# Altium schematic sheet LED Driver.SchDoc
size Letter
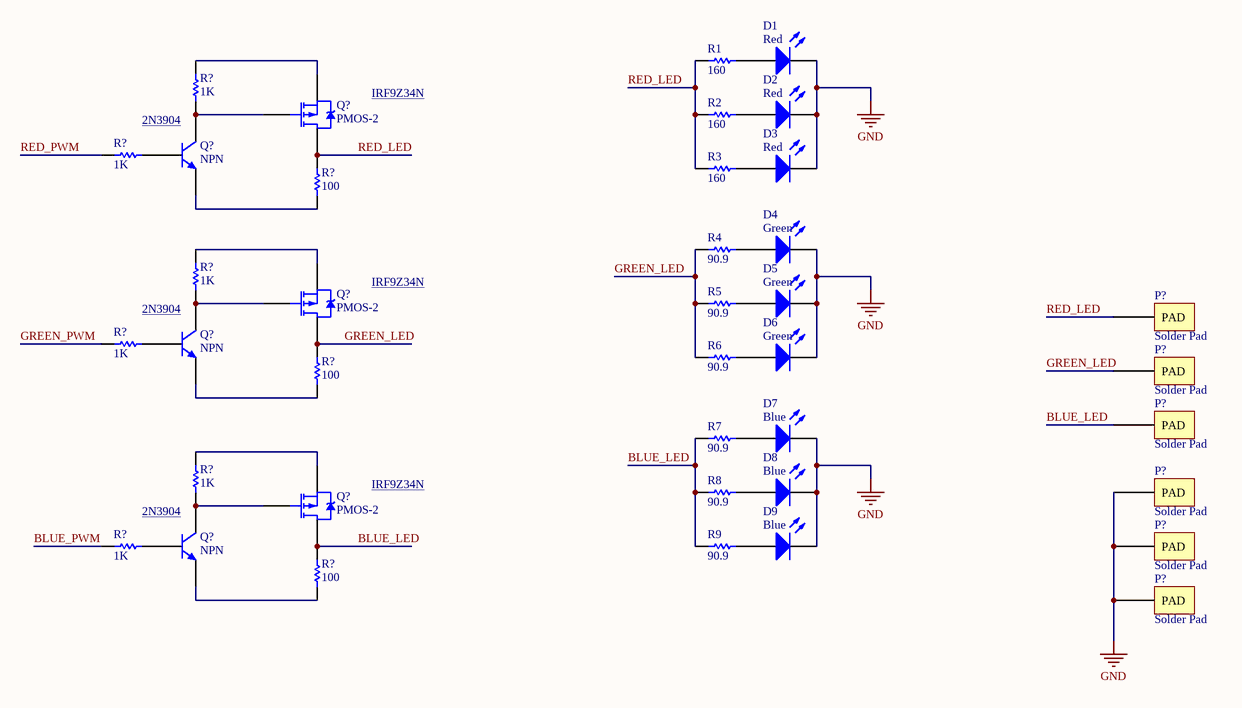
[diagram p0: LED Driver.SchDoc]

## Parts
(Parts that share a designator on the sheet are numbered #1, #2 ... from top to bottom, then left to right.)
D1  Red  [LED-5MM]
D2  Red  [LED-5MM]
D3  Red  [LED-5MM]
D4  Green  [LED-5MM]
D5  Green  [LED-5MM]
D6  Green  [LED-5MM]
D7  Blue  [LED-5MM]
D8  Blue  [LED-5MM]
D9  Blue  [LED-5MM]
P?#1  Solder Pad  [Solder Pad]
P?#2  Solder Pad  [Solder Pad]
P?#3  Solder Pad  [Solder Pad]
P?#4  Solder Pad  [Solder Pad]
P?#5  Solder Pad  [Solder Pad]
P?#6  Solder Pad  [Solder Pad]
Q?#1  PMOS-2  [TO-220AB]
Q?#2  NPN  [TO-226-AA]
Q?#3  PMOS-2  [TO-220AB]
Q?#4  NPN  [TO-226-AA]
Q?#5  PMOS-2  [TO-220AB]
Q?#6  NPN  [TO-226-AA]
R1  160  [RES_8085]
R2  160  [RES_8085]
R3  160  [RES_8085]
R4  90.9  [RES_8085]
R5  90.9  [RES_8085]
R6  90.9  [RES_8085]
R7  90.9  [RES_8085]
R8  90.9  [RES_8085]
R9  90.9  [RES_8085]
R?#1  1K  [RES_8085]
R?#2  1K  [RES_8085]
R?#3  100  [RES_8085]
R?#4  1K  [RES_8085]
R?#5  1K  [RES_8085]
R?#6  100  [RES_8085]
R?#7  1K  [RES_8085]
R?#8  1K  [RES_8085]
R?#9  100  [RES_8085]

## Nets
GND: D1.2(K) D2.2(K) D3.2(K) D4.2(K) D5.2(K) D6.2(K) D7.2(K) D8.2(K) D9.2(K) P?#4.0(PAD) P?#5.0(PAD) P?#6.0(PAD)
BLUE_LED: P?#3.0(PAD) Q?#5.2(D) R7.1 R8.1 R9.1 R?#9.2
BLUE_PWM: R?#8.1
GREEN_LED: P?#2.0(PAD) Q?#3.2(D) R4.1 R5.1 R6.1 R?#6.2
GREEN_PWM: R?#5.1
RED_LED: P?#1.0(PAD) Q?#1.2(D) R1.1 R2.1 R3.1 R?#3.2
RED_PWM: R?#2.1
NetD1_1: D1.1(A) R1.2
NetD2_1: D2.1(A) R2.2
NetD3_1: D3.1(A) R3.2
NetD4_1: D4.1(A) R4.2
NetD5_1: D5.1(A) R5.2
NetD6_1: D6.1(A) R6.2
NetD7_1: D7.1(A) R7.2
NetD8_1: D8.1(A) R8.2
NetD9_1: D9.1(A) R9.2
NetQ?#1_1: Q?#1.1(G) Q?#2.1(C) R?#1.1
NetQ?#1_3: Q?#1.3(S) R?#1.2
NetQ?#2_2: Q?#2.2(B) R?#2.2
NetQ?#2_3: Q?#2.3(E) R?#3.1
NetQ?#3_1: Q?#3.1(G) Q?#4.1(C) R?#4.1
NetQ?#3_3: Q?#3.3(S) R?#4.2
NetQ?#4_2: Q?#4.2(B) R?#5.2
NetQ?#4_3: Q?#4.3(E) R?#6.1
NetQ?#5_1: Q?#5.1(G) Q?#6.1(C) R?#7.1
NetQ?#5_3: Q?#5.3(S) R?#7.2
NetQ?#6_2: Q?#6.2(B) R?#8.2
NetQ?#6_3: Q?#6.3(E) R?#9.1

## Notes on the sheet
- IRF9Z34N
- 2N3904

## Library data of the parts
D1-D9 = D_LED: General Purpose LED; ComponentLink2Description: Green 5mm (C503B-GCS-CY0C0791); ComponentLink1URL: http://www.cree.com/~/media/Files/Cree/LED%20Components%20and%20Modules/HB/Data%20Sheets/C503B%20RAS%20RAN%20AAS%20AAN%20RBS%20RBN%20ABS%20ABN%20RCS%20RCN%20ACS%20ACN%201079.pdf; Supplier 1: Digi-Key; Supplier 2: Digi-Key; Supplier 3: Digi-Key; Supplier Part Number 1: C503B-GCS-CY0C0791-ND; Supplier Part Number 2: C503B-BAN-CY0C0461-ND; Supplier Part Number 3: C503B-RAS-CY0B0AA1-ND; ComponentLink3Description: Blue 5mm (C503B-BAN-CY0C0461); ComponentLink1Description: Red 5mm (C503B-RAS-CY0B0AA1); ComponentLink2URL: http://www.cree.com/~/media/Files/Cree/LED%20Components%20and%20Modules/HB/Data%20Sheets/C503B%20BAS%20BAN%20BCS%20BCN%20GAS%20GAN%20GCS%20GCN%201094.pdf; ComponentLink3URL: http://www.cree.com/sitecore%20modules/web/~/media/Files/Cree/LED%20Components%20and%20Modules/HB/Data%20Sheets/1300%20C503B%20BAS%20BAN%20GAS%20GAN.pdf
Q?#1 Q?#3 Q?#5 = PMOS-2: P-Channel Power MOSFET; Note: Pin 4 not drawn and electrically connected to Pin 2.; Published: 8-Jun-2000; LatestRevisionDate: 17-Jul-2002; LatestRevisionNote: Re-released for DXP Platform.; DatasheetVersion: PD-9.390D; PackageVersion: Feb-1997; PackageReference: TO-220AB; Publisher: Altium Limited; PackageDescription: TO, Thru-Hole, Vertical, Heatsink Mounted; 3 In-Line Leads; Pitch 2.54 mm; ComponentLink1Description: Manufacturer Link; ComponentLink1URL: http://www.irf.com/
Q?#2 Q?#4 Q?#6 = NPN: NPN Bipolar Transistor; Published: 8-Jun-2000; LatestRevisionDate: 17-Jul-2002; LatestRevisionNote: Re-released for DXP Platform.; PackageReference: TO-226-AA; Publisher: Altium Limited; PackageDescription: TO, Flat Index; 3 In-Line, Axial Leads; Body Dia. 4.8mm; Leads 0.55 x 0.51 mm (max); Code_JEDEC: TO-226-AA
R1-R9 R?#1-R?#9 = CHIP-RES: SMD Chip Resistor
  R1-R3: Value: 160
  R4-R9: Value: 90.9
  R?#1 R?#2 R?#4 R?#5 R?#7 R?#8: Value: 1K
  R?#3 R?#6 R?#9: Value: 100